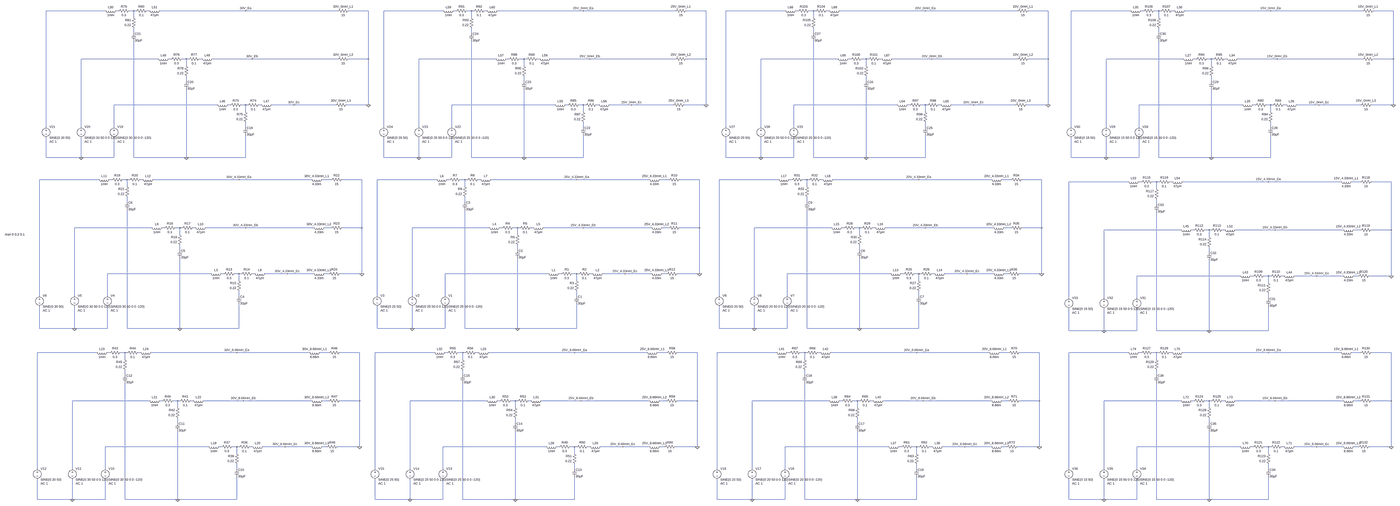
[diagram p0: schematic LCLFilters.asc, whole sheet]
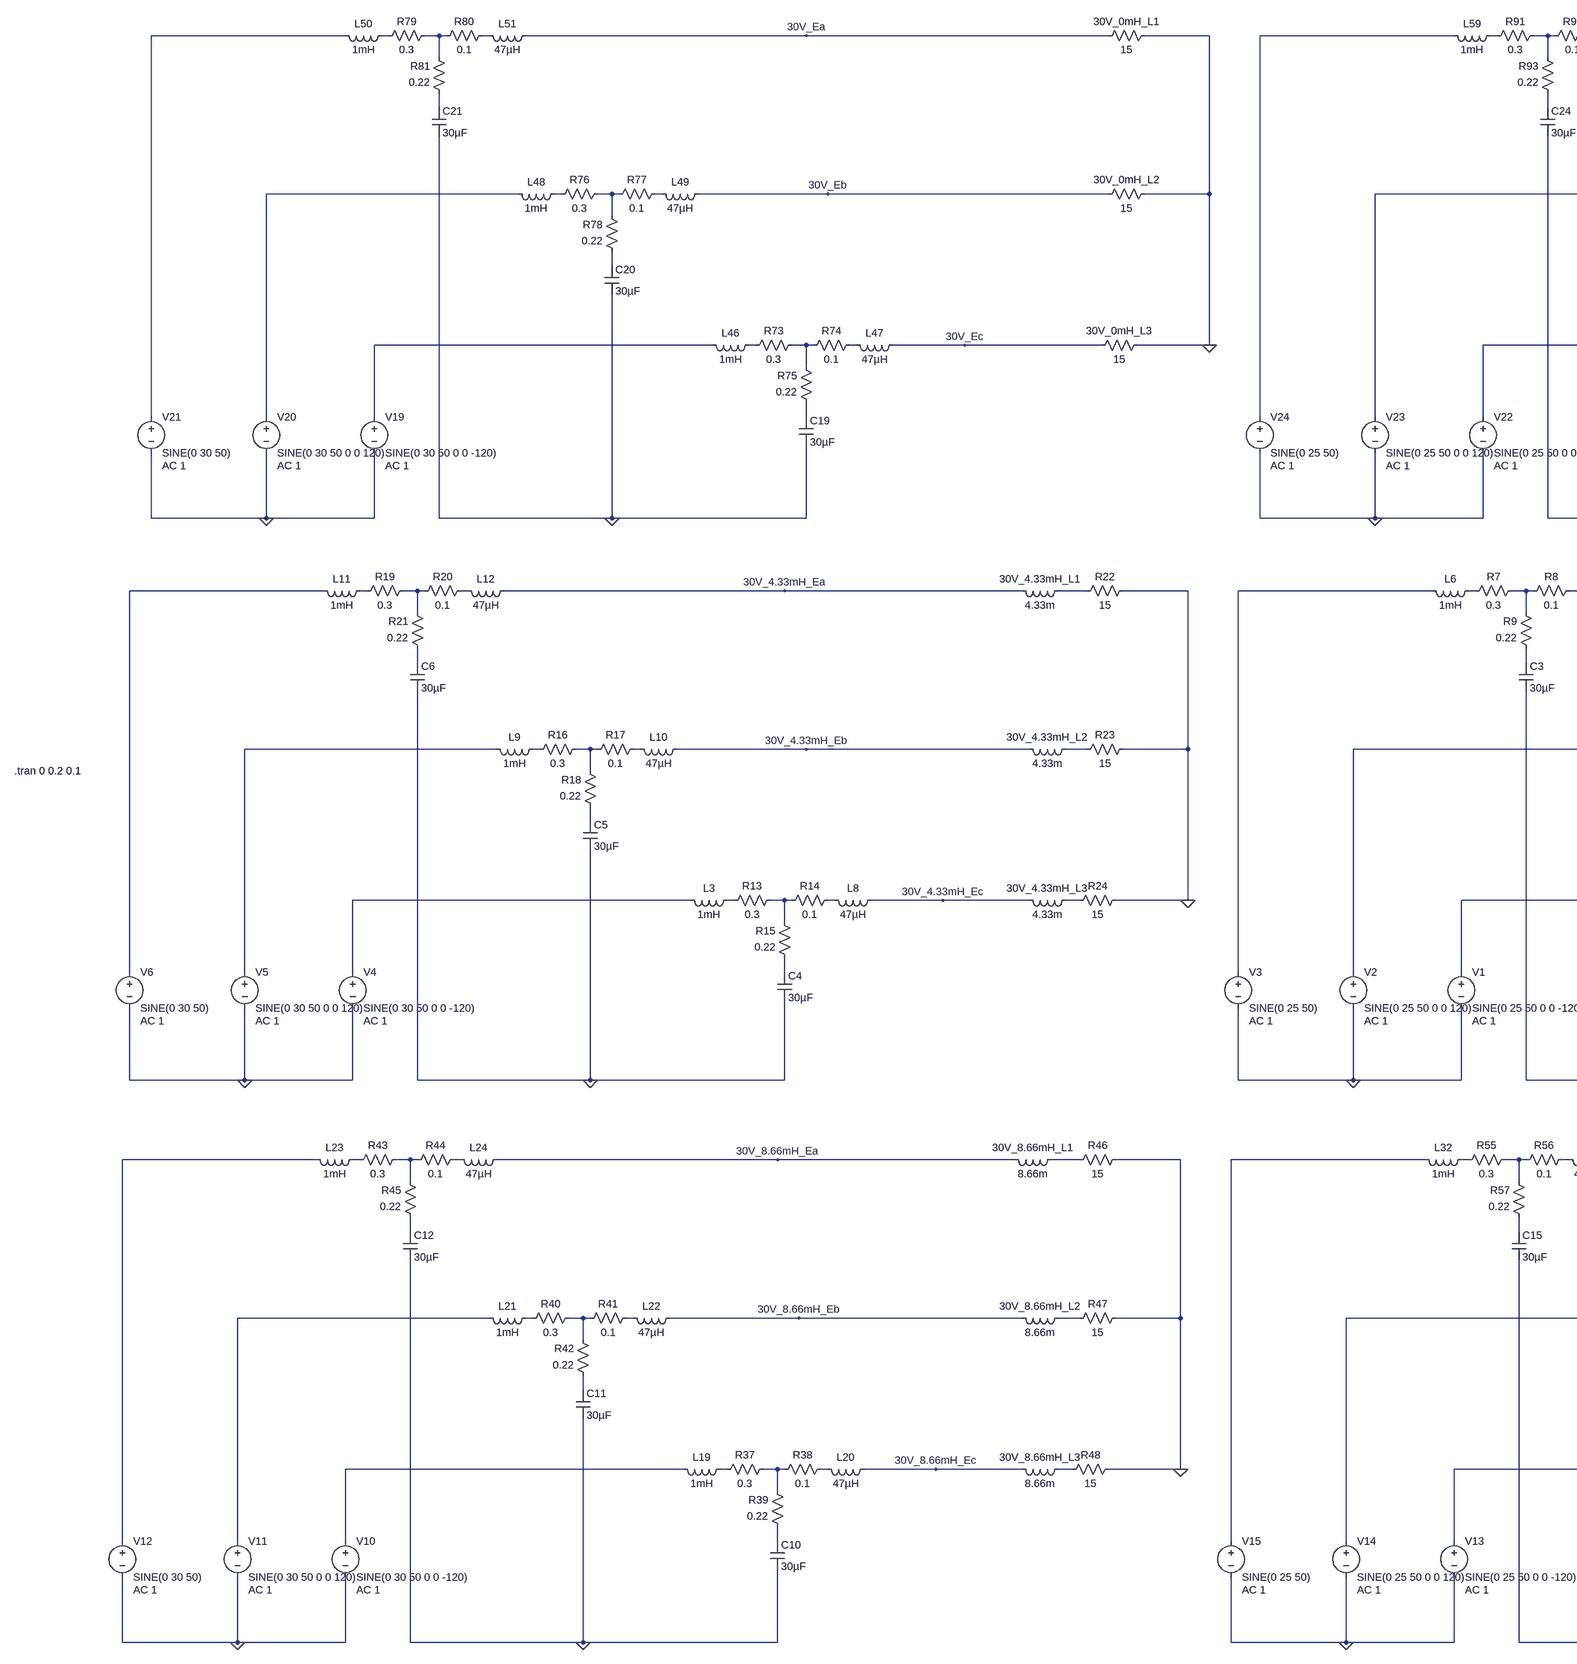
[diagram p1: schematic LCLFilters.asc, part, row 1 of 1, column 1 of 3]
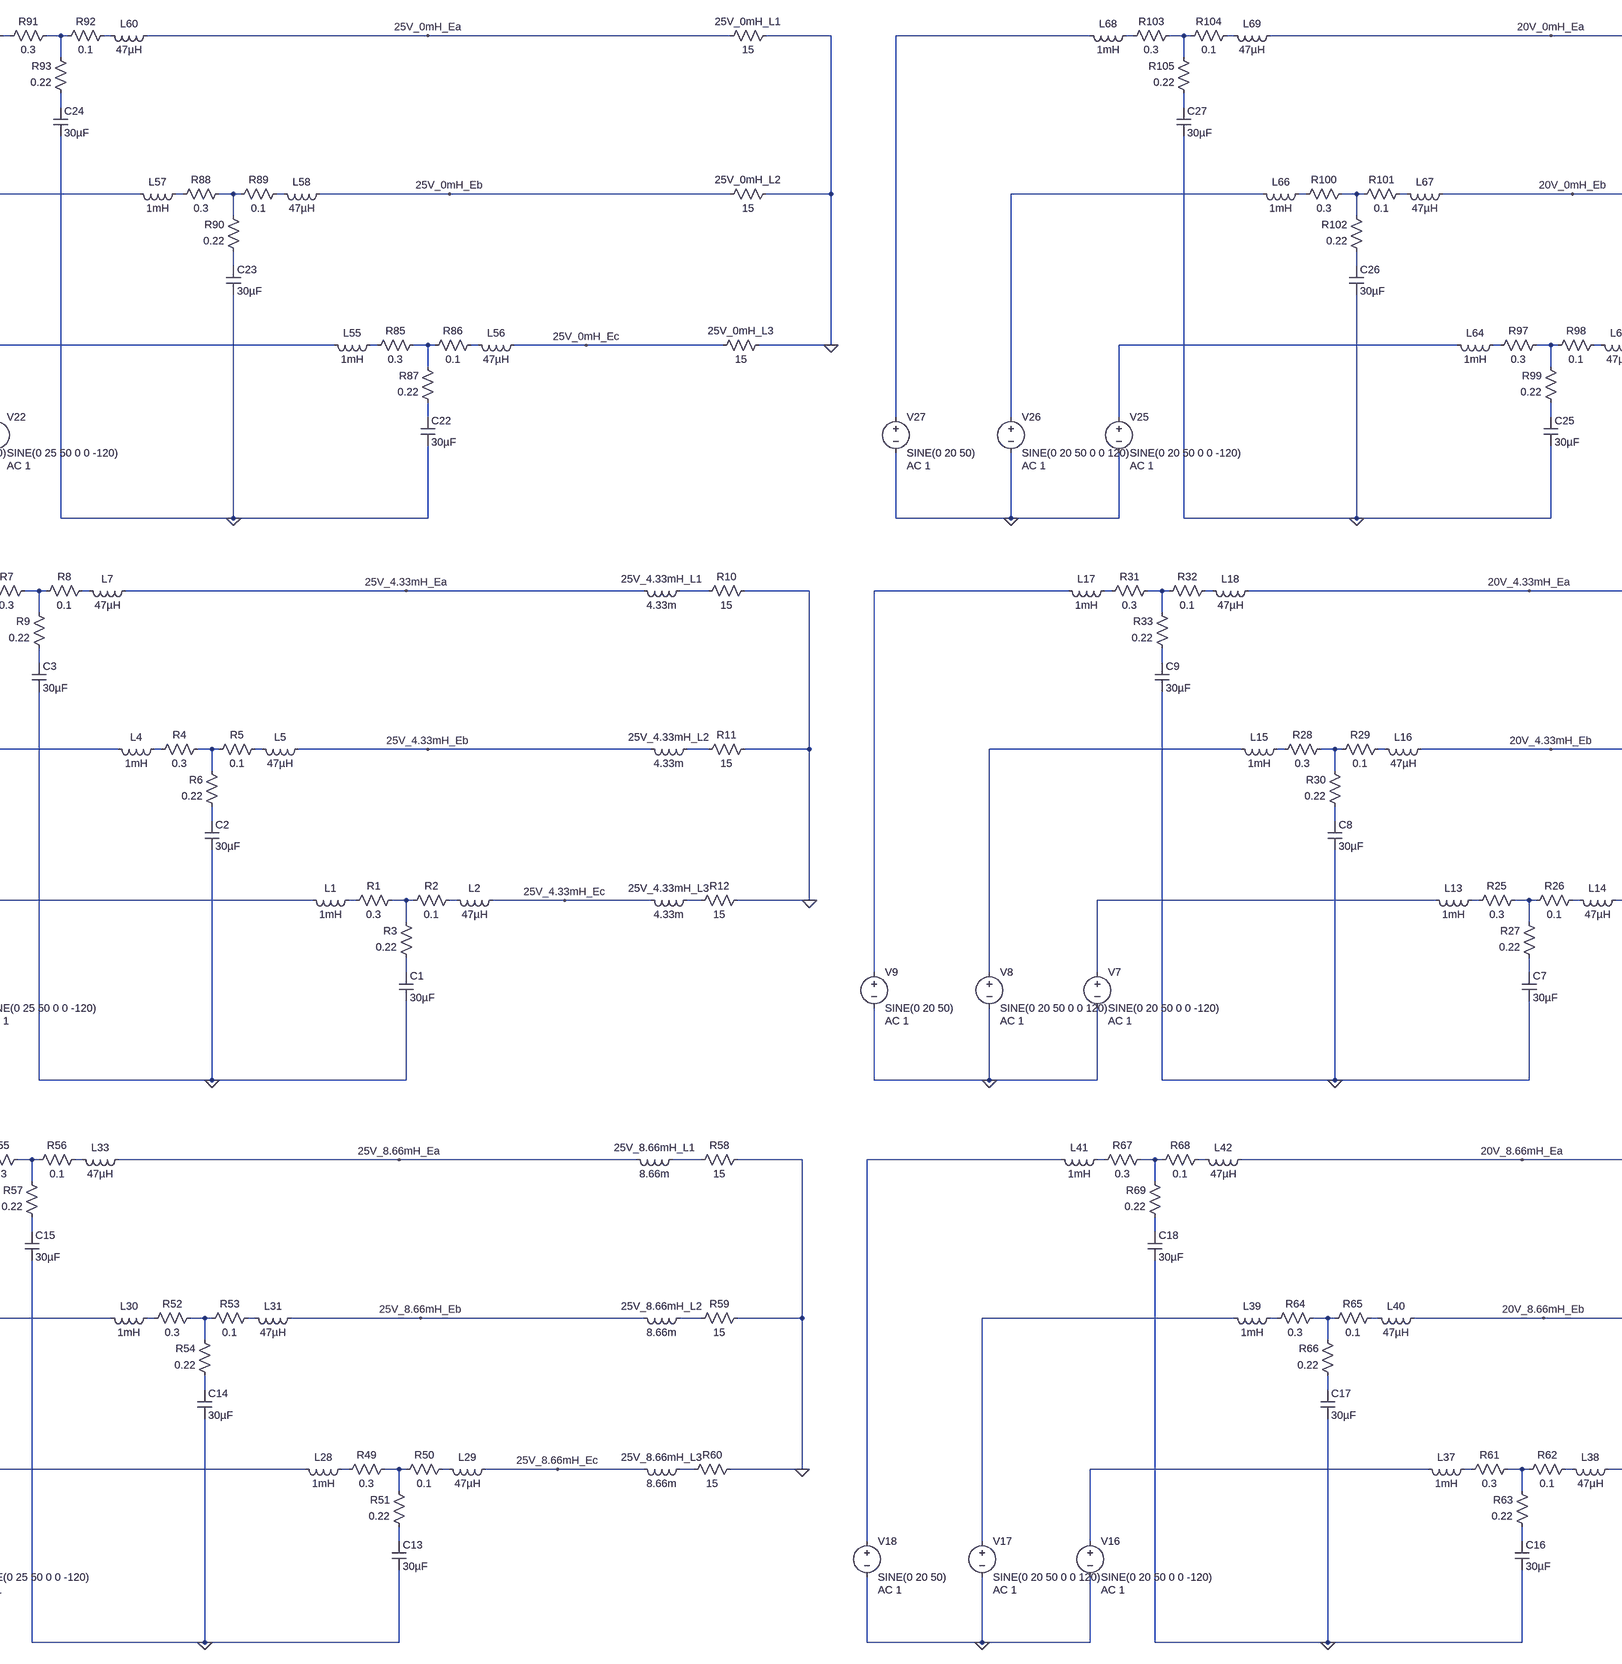
[diagram p2: schematic LCLFilters.asc, part, row 1 of 1, column 2 of 3]
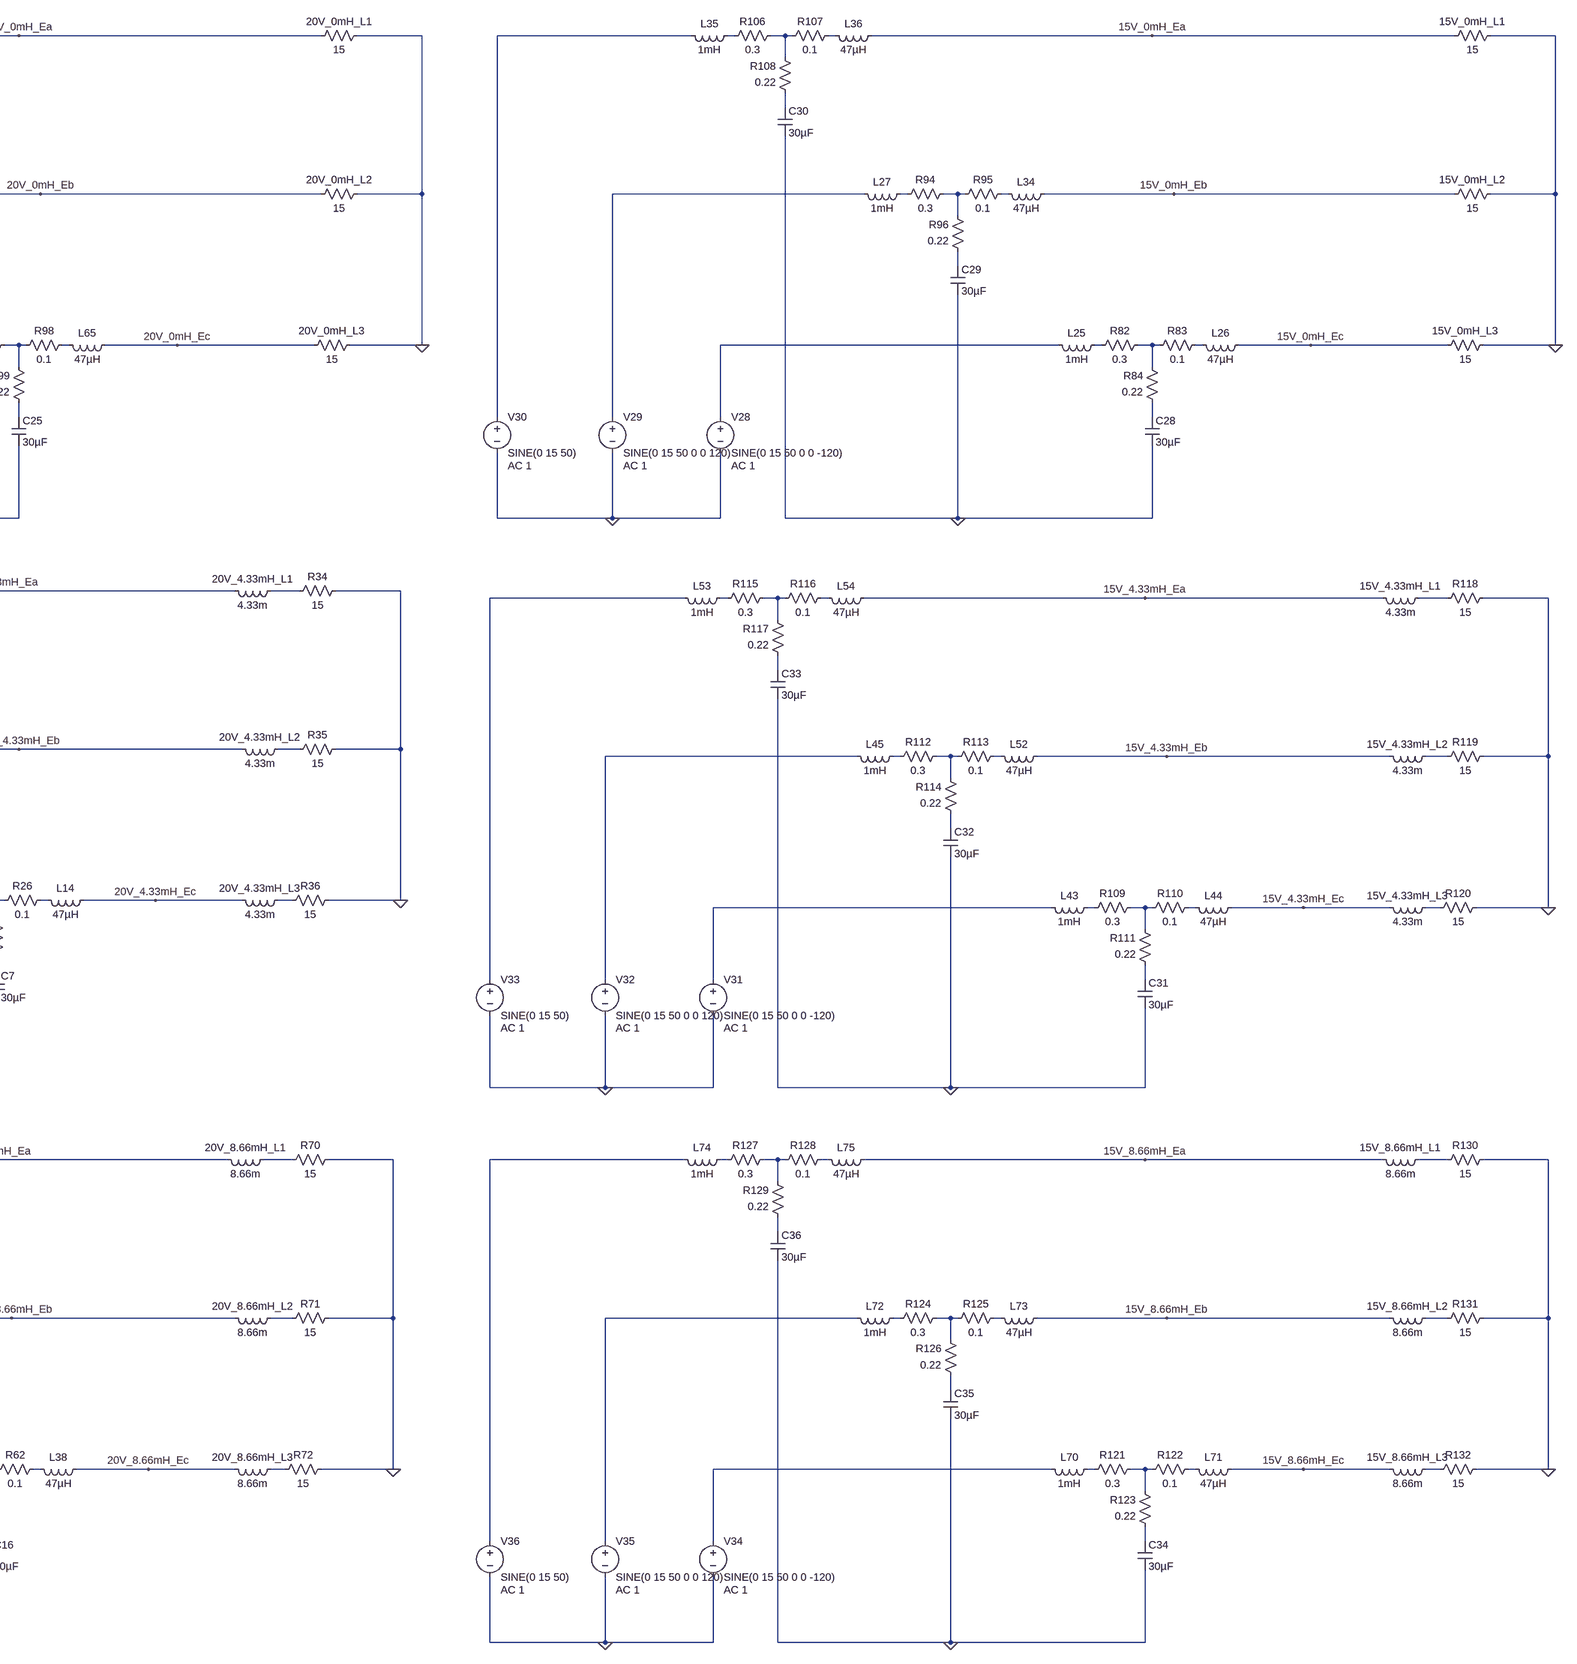
[diagram p3: schematic LCLFilters.asc, part, row 1 of 1, column 3 of 3]
* LCLFilters.asc
L3 N110 N109 1mH
L8 30V_4.33mH_Ec N112 47µH
R13 N111 N110 0.3
R14 N112 N111 0.1
R15 N129 N111 0.22
C4 N129 0 30µF
V4 N109 0 SINE(0 30 50 0 0 -120) AC 1
V5 N085 0 SINE(0 30 50 0 0 120) AC 1
V6 N061 0 SINE(0 30 50) AC 1
L9 N086 N085 1mH
L10 30V_4.33mH_Eb N088 47µH
R16 N087 N086 0.3
R17 N088 N087 0.1
R18 N105 N087 0.22
C5 N105 0 30µF
L11 N062 N061 1mH
L12 30V_4.33mH_Ea N064 47µH
R19 N063 N062 0.3
R20 N064 N063 0.1
R21 N081 N063 0.22
C6 N081 0 30µF
R22 0 N065 15
R23 0 N089 15
R24 0 N113 15
L§30V_4.33mH_L1 N065 30V_4.33mH_Ea 4.33m
L§30V_4.33mH_L2 N089 30V_4.33mH_Eb 4.33m
L§30V_4.33mH_L3 N113 30V_4.33mH_Ec 4.33m
L1 N115 N114 1mH
L2 25V_4.33mH_Ec N117 47µH
R1 N116 N115 0.3
R2 N117 N116 0.1
R3 N130 N116 0.22
C1 N130 0 30µF
V1 N114 0 SINE(0 25 50 0 0 -120) AC 1
V2 N090 0 SINE(0 25 50 0 0 120) AC 1
V3 N066 0 SINE(0 25 50) AC 1
L4 N091 N090 1mH
L5 25V_4.33mH_Eb N093 47µH
R4 N092 N091 0.3
R5 N093 N092 0.1
R6 N106 N092 0.22
C2 N106 0 30µF
L6 N067 N066 1mH
L7 25V_4.33mH_Ea N069 47µH
R7 N068 N067 0.3
R8 N069 N068 0.1
R9 N082 N068 0.22
C3 N082 0 30µF
R10 0 N070 15
R11 0 N094 15
R12 0 N118 15
L§25V_4.33mH_L1 N070 25V_4.33mH_Ea 4.33m
L§25V_4.33mH_L2 N094 25V_4.33mH_Eb 4.33m
L§25V_4.33mH_L3 N118 25V_4.33mH_Ec 4.33m
L13 N120 N119 1mH
L14 20V_4.33mH_Ec N122 47µH
R25 N121 N120 0.3
R26 N122 N121 0.1
R27 N131 N121 0.22
C7 N131 0 30µF
V7 N119 0 SINE(0 20 50 0 0 -120) AC 1
V8 N095 0 SINE(0 20 50 0 0 120) AC 1
V9 N071 0 SINE(0 20 50) AC 1
L15 N096 N095 1mH
L16 20V_4.33mH_Eb N098 47µH
R28 N097 N096 0.3
R29 N098 N097 0.1
R30 N107 N097 0.22
C8 N107 0 30µF
L17 N072 N071 1mH
L18 20V_4.33mH_Ea N074 47µH
R31 N073 N072 0.3
R32 N074 N073 0.1
R33 N083 N073 0.22
C9 N083 0 30µF
R34 0 N075 15
R35 0 N099 15
R36 0 N123 15
L§20V_4.33mH_L1 N075 20V_4.33mH_Ea 4.33m
L§20V_4.33mH_L2 N099 20V_4.33mH_Eb 4.33m
L§20V_4.33mH_L3 N123 20V_4.33mH_Ec 4.33m
L19 N182 N181 1mH
L20 30V_8.66mH_Ec N184 47µH
R37 N183 N182 0.3
R38 N184 N183 0.1
R39 N201 N183 0.22
C10 N201 0 30µF
V10 N181 0 SINE(0 30 50 0 0 -120) AC 1
V11 N157 0 SINE(0 30 50 0 0 120) AC 1
V12 N133 0 SINE(0 30 50) AC 1
L21 N158 N157 1mH
L22 30V_8.66mH_Eb N160 47µH
R40 N159 N158 0.3
R41 N160 N159 0.1
R42 N177 N159 0.22
C11 N177 0 30µF
L23 N134 N133 1mH
L24 30V_8.66mH_Ea N136 47µH
R43 N135 N134 0.3
R44 N136 N135 0.1
R45 N153 N135 0.22
C12 N153 0 30µF
R46 0 N137 15
R47 0 N161 15
R48 0 N185 15
L§30V_8.66mH_L1 N137 30V_8.66mH_Ea 8.66m
L§30V_8.66mH_L2 N161 30V_8.66mH_Eb 8.66m
L§30V_8.66mH_L3 N185 30V_8.66mH_Ec 8.66m
L28 N187 N186 1mH
L29 25V_8.66mH_Ec N189 47µH
R49 N188 N187 0.3
R50 N189 N188 0.1
R51 N202 N188 0.22
C13 N202 0 30µF
V13 N186 0 SINE(0 25 50 0 0 -120) AC 1
V14 N162 0 SINE(0 25 50 0 0 120) AC 1
V15 N138 0 SINE(0 25 50) AC 1
L30 N163 N162 1mH
L31 25V_8.66mH_Eb N165 47µH
R52 N164 N163 0.3
R53 N165 N164 0.1
R54 N178 N164 0.22
C14 N178 0 30µF
L32 N139 N138 1mH
L33 25V_8.66mH_Ea N141 47µH
R55 N140 N139 0.3
R56 N141 N140 0.1
R57 N154 N140 0.22
C15 N154 0 30µF
R58 0 N142 15
R59 0 N166 15
R60 0 N190 15
L§25V_8.66mH_L1 N142 25V_8.66mH_Ea 8.66m
L§25V_8.66mH_L2 N166 25V_8.66mH_Eb 8.66m
L§25V_8.66mH_L3 N190 25V_8.66mH_Ec 8.66m
L37 N192 N191 1mH
L38 20V_8.66mH_Ec N194 47µH
R61 N193 N192 0.3
R62 N194 N193 0.1
R63 N203 N193 0.22
C16 N203 0 30µF
V16 N191 0 SINE(0 20 50 0 0 -120) AC 1
V17 N167 0 SINE(0 20 50 0 0 120) AC 1
V18 N143 0 SINE(0 20 50) AC 1
L39 N168 N167 1mH
L40 20V_8.66mH_Eb N170 47µH
R64 N169 N168 0.3
R65 N170 N169 0.1
R66 N179 N169 0.22
C17 N179 0 30µF
L41 N144 N143 1mH
L42 20V_8.66mH_Ea N146 47µH
R67 N145 N144 0.3
R68 N146 N145 0.1
R69 N155 N145 0.22
C18 N155 0 30µF
R70 0 N147 15
R71 0 N171 15
R72 0 N195 15
L§20V_8.66mH_L1 N147 20V_8.66mH_Ea 8.66m
L§20V_8.66mH_L2 N171 20V_8.66mH_Eb 8.66m
L§20V_8.66mH_L3 N195 20V_8.66mH_Ec 8.66m
L46 N042 N041 1mH
L47 30V_Ec N044 47µH
R73 N043 N042 0.3
R74 N044 N043 0.1
R75 N057 N043 0.22
C19 N057 0 30µF
V19 N041 0 SINE(0 30 50 0 0 -120) AC 1
V20 N021 0 SINE(0 30 50 0 0 120) AC 1
V21 N001 0 SINE(0 30 50) AC 1
L48 N022 N021 1mH
L49 30V_Eb N024 47µH
R76 N023 N022 0.3
R77 N024 N023 0.1
R78 N037 N023 0.22
C20 N037 0 30µF
L50 N002 N001 1mH
L51 30V_Ea N004 47µH
R79 N003 N002 0.3
R80 N004 N003 0.1
R81 N017 N003 0.22
C21 N017 0 30µF
R§30V_0mH_L1 0 30V_Ea 15
R§30V_0mH_L2 0 30V_Eb 15
R§30V_0mH_L3 0 30V_Ec 15
L55 N046 N045 1mH
L56 25V_0mH_Ec N048 47µH
R85 N047 N046 0.3
R86 N048 N047 0.1
R87 N058 N047 0.22
C22 N058 0 30µF
V22 N045 0 SINE(0 25 50 0 0 -120) AC 1
V23 N025 0 SINE(0 25 50 0 0 120) AC 1
V24 N005 0 SINE(0 25 50) AC 1
L57 N026 N025 1mH
L58 25V_0mH_Eb N028 47µH
R88 N027 N026 0.3
R89 N028 N027 0.1
R90 N038 N027 0.22
C23 N038 0 30µF
L59 N006 N005 1mH
L60 25V_0mH_Ea N008 47µH
R91 N007 N006 0.3
R92 N008 N007 0.1
R93 N018 N007 0.22
C24 N018 0 30µF
R§25V_0mH_L1 0 25V_0mH_Ea 15
R§25V_0mH_L2 0 25V_0mH_Eb 15
R§25V_0mH_L3 0 25V_0mH_Ec 15
L64 N050 N049 1mH
L65 20V_0mH_Ec N052 47µH
R97 N051 N050 0.3
R98 N052 N051 0.1
R99 N059 N051 0.22
C25 N059 0 30µF
V25 N049 0 SINE(0 20 50 0 0 -120) AC 1
V26 N029 0 SINE(0 20 50 0 0 120) AC 1
V27 N009 0 SINE(0 20 50) AC 1
L66 N030 N029 1mH
L67 20V_0mH_Eb N032 47µH
R100 N031 N030 0.3
R101 N032 N031 0.1
R102 N039 N031 0.22
C26 N039 0 30µF
L68 N010 N009 1mH
L69 20V_0mH_Ea N012 47µH
R103 N011 N010 0.3
R104 N012 N011 0.1
R105 N019 N011 0.22
C27 N019 0 30µF
R§20V_0mH_L1 0 20V_0mH_Ea 15
R§20V_0mH_L2 0 20V_0mH_Eb 15
R§20V_0mH_L3 0 20V_0mH_Ec 15
L25 N054 N053 1mH
L26 15V_0mH_Ec N056 47µH
R82 N055 N054 0.3
R83 N056 N055 0.1
R84 N060 N055 0.22
C28 N060 0 30µF
V28 N053 0 SINE(0 15 50 0 0 -120) AC 1
V29 N033 0 SINE(0 15 50 0 0 120) AC 1
L27 N034 N033 1mH
L34 15V_0mH_Eb N036 47µH
R94 N035 N034 0.3
R95 N036 N035 0.1
R96 N040 N035 0.22
C29 N040 0 30µF
L35 N014 N013 1mH
L36 15V_0mH_Ea N016 47µH
R106 N015 N014 0.3
R107 N016 N015 0.1
R108 N020 N015 0.22
C30 N020 0 30µF
R§15V_0mH_L1 0 15V_0mH_Ea 15
R§15V_0mH_L2 0 15V_0mH_Eb 15
R§15V_0mH_L3 0 15V_0mH_Ec 15
V30 N013 0 SINE(0 15 50) AC 1
L43 N125 N124 1mH
L44 15V_4.33mH_Ec N127 47µH
R109 N126 N125 0.3
R110 N127 N126 0.1
R111 N132 N126 0.22
C31 N132 0 30µF
V31 N124 0 SINE(0 15 50 0 0 -120) AC 1
V32 N100 0 SINE(0 15 50 0 0 120) AC 1
V33 N076 0 SINE(0 15 50) AC 1
L45 N101 N100 1mH
L52 15V_4.33mH_Eb N103 47µH
R112 N102 N101 0.3
R113 N103 N102 0.1
R114 N108 N102 0.22
C32 N108 0 30µF
L53 N077 N076 1mH
L54 15V_4.33mH_Ea N079 47µH
R115 N078 N077 0.3
R116 N079 N078 0.1
R117 N084 N078 0.22
C33 N084 0 30µF
R118 0 N080 15
R119 0 N104 15
R120 0 N128 15
L§15V_4.33mH_L1 N080 15V_4.33mH_Ea 4.33m
L§15V_4.33mH_L2 N104 15V_4.33mH_Eb 4.33m
L§15V_4.33mH_L3 N128 15V_4.33mH_Ec 4.33m
L70 N197 N196 1mH
L71 15V_8.66mH_Ec N199 47µH
R121 N198 N197 0.3
R122 N199 N198 0.1
R123 N204 N198 0.22
C34 N204 0 30µF
V34 N196 0 SINE(0 15 50 0 0 -120) AC 1
V35 N172 0 SINE(0 15 50 0 0 120) AC 1
V36 N148 0 SINE(0 15 50) AC 1
L72 N173 N172 1mH
L73 15V_8.66mH_Eb N175 47µH
R124 N174 N173 0.3
R125 N175 N174 0.1
R126 N180 N174 0.22
C35 N180 0 30µF
L74 N149 N148 1mH
L75 15V_8.66mH_Ea N151 47µH
R127 N150 N149 0.3
R128 N151 N150 0.1
R129 N156 N150 0.22
C36 N156 0 30µF
R130 0 N152 15
R131 0 N176 15
R132 0 N200 15
L§15V_8.66mH_L1 N152 15V_8.66mH_Ea 8.66m
L§15V_8.66mH_L2 N176 15V_8.66mH_Eb 8.66m
L§15V_8.66mH_L3 N200 15V_8.66mH_Ec 8.66m
.tran 0 0.2 0.1
.backanno
.end